# EAGLE schematic schematic (EAGLE 7.5.0)

## Sheet 1 of 3: Supply
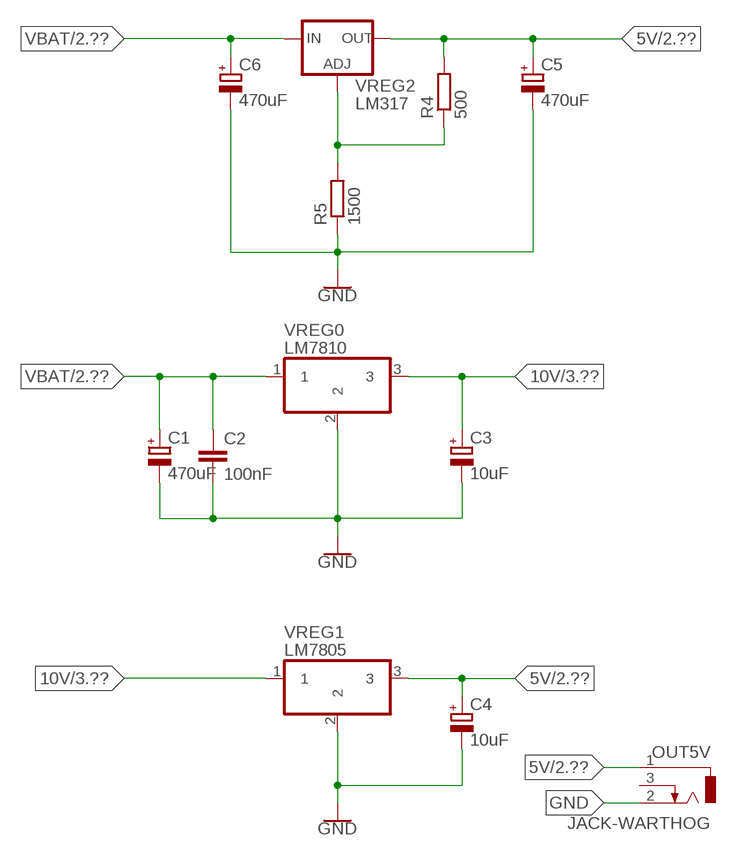
[diagram p0: schematic, sheet 1]

### Parts
C1  470uF  CPOL-EUE3.5-8  [E3,5-8]
C2  100nF  C-EUC0805  [C0805]
C3  10uF  CPOL-EUSMCC  [SMC_C]
C4  10uF  CPOL-EUSMCC  [SMC_C]
C5  470uF  CPOL-EUSMCC  [SMC_C]
C6  470uF  CPOL-EUSMCC  [SMC_C]
OUT5V  JACK-WARTHOG  [JACK-WARTHOG]
R4  500  R-EU_R0805  [R0805]
R5  1500  R-EU_R0805  [R0805]
VREG0  LM7810  TO220V-WARTHOG  [TO220V-WARTHOG]
VREG1  LM7805  TO220V-WARTHOG  [TO220V-WARTHOG]
VREG2  LM317  V_REG_317DPACK  [V-REG_DPACK]

### Nets
5V: C4.+ C5.+ OUT5V.1 R4.2 VREG1.3 VREG2.4(OUT) ; also sheet 2,3
10V: C3.+ VREG0.3 VREG1.1 ; also sheet 3
ADJ: R4.1 R5.2 VREG2.1(ADJ)
GND: C1.- C2.2 C3.- C4.- C5.- C6.- OUT5V.2 R5.1 VREG0.2 VREG1.2 ; also sheet 2,3
VBAT: C1.+ C2.1 C6.+ VREG0.1 VREG2.3(IN) ; also sheet 2,3
Unconnected: OUT5V.3

## Sheet 2 of 3
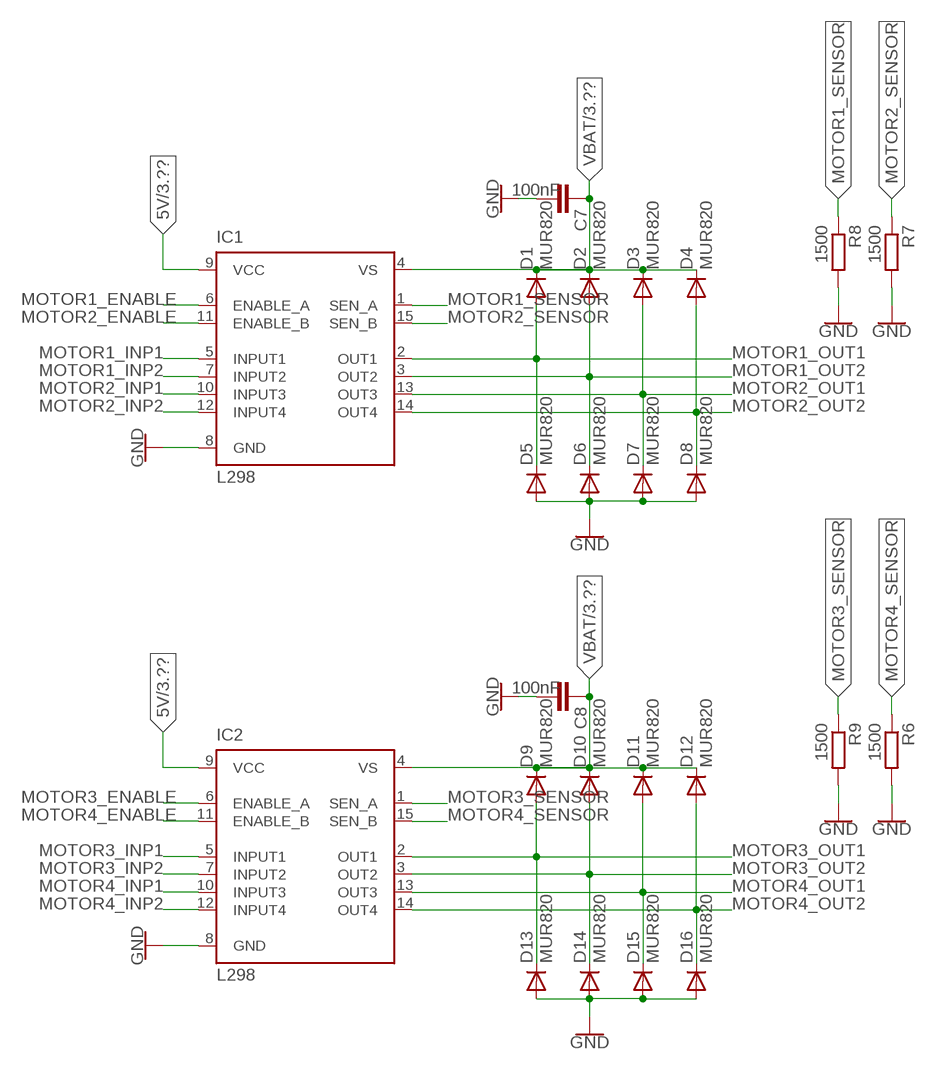
[diagram p1: schematic, sheet 2]

### Parts
C7  100nF  C-EUC0805  [C0805]
C8  100nF  C-EUC0805  [C0805]
D1  MUR820  [C221B1A]
D2  MUR820  [C221B1A]
D3  MUR820  [C221B1A]
D4  MUR820  [C221B1A]
D5  MUR820  [C221B1A]
D6  MUR820  [C221B1A]
D7  MUR820  [C221B1A]
D8  MUR820  [C221B1A]
D9  MUR820  [C221B1A]
D10  MUR820  [C221B1A]
D11  MUR820  [C221B1A]
D12  MUR820  [C221B1A]
D13  MUR820  [C221B1A]
D14  MUR820  [C221B1A]
D15  MUR820  [C221B1A]
D16  MUR820  [C221B1A]
IC1  L298  [MULTIWATT-15]
IC2  L298  [MULTIWATT-15]
R6  1500  R-EU_R0805  [R0805]
R7  1500  R-EU_R0805  [R0805]
R8  1500  R-EU_R0805  [R0805]
R9  1500  R-EU_R0805  [R0805]

### Nets
5V: IC1.9(VCC) IC2.9(VCC) ; also sheet 1,3
GND: C7.2 C8.2 D5.A D6.A D7.A D8.A D13.A D14.A D15.A D16.A IC1.8(GND) IC2.8(GND) R6.2 R7.2 R8.2 R9.2 ; also sheet 1,3
MOTOR1_ENABLE: IC1.6(ENABLE_A)
MOTOR1_INP1: IC1.5(INPUT1)
MOTOR1_INP2: IC1.7(INPUT2)
MOTOR1_OUT1: D1.A D5.C IC1.2(OUT1)
MOTOR1_OUT2: D2.A D6.C IC1.3(OUT2)
MOTOR1_SENSOR: IC1.1(SEN_A) R8.1
MOTOR2_ENABLE: IC1.11(ENABLE_B)
MOTOR2_INP1: IC1.10(INPUT3)
MOTOR2_INP2: IC1.12(INPUT4)
MOTOR2_OUT1: D3.A D7.C IC1.13(OUT3)
MOTOR2_OUT2: D4.A D8.C IC1.14(OUT4)
MOTOR2_SENSOR: IC1.15(SEN_B) R7.1
MOTOR3_ENABLE: IC2.6(ENABLE_A)
MOTOR3_INP1: IC2.5(INPUT1)
MOTOR3_INP2: IC2.7(INPUT2)
MOTOR3_OUT1: D9.A D13.C IC2.2(OUT1)
MOTOR3_OUT2: D10.A D14.C IC2.3(OUT2)
MOTOR3_SENSOR: IC2.1(SEN_A) R9.1
MOTOR4_ENABLE: IC2.11(ENABLE_B)
MOTOR4_INP1: IC2.10(INPUT3)
MOTOR4_INP2: IC2.12(INPUT4)
MOTOR4_OUT1: D11.A D15.C IC2.13(OUT3)
MOTOR4_OUT2: D12.A D16.C IC2.14(OUT4)
MOTOR4_SENSOR: IC2.15(SEN_B) R6.1
VBAT: C7.1 C8.1 D1.C D2.C D3.C D4.C D9.C D10.C D11.C D12.C IC1.4(VS) IC2.4(VS) ; also sheet 1,3

## Sheet 3 of 3: Debug
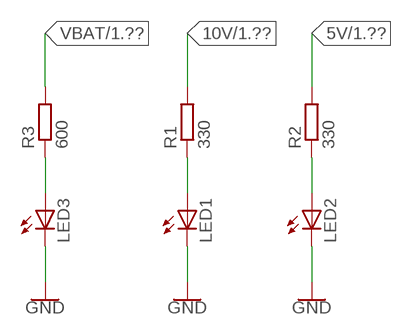
[diagram p2: schematic, sheet 3]

### Parts
LED1  LEDCHIP-LED0805  [CHIP-LED0805]
LED2  LEDCHIP-LED0805  [CHIP-LED0805]
LED3  LEDCHIP-LED0805  [CHIP-LED0805]
R1  330  R-EU_R0805  [R0805]
R2  330  R-EU_R0805  [R0805]
R3  600  R-EU_R0805  [R0805]

### Nets
5V: R2.2 ; also sheet 1,2
10V: R1.2 ; also sheet 1
GND: LED1.C LED2.C LED3.C ; also sheet 1,2
N$1: LED1.A R1.1
N$2: LED2.A R2.1
N$3: LED3.A R3.1
VBAT: R3.2 ; also sheet 1,2

## Library data of the parts
C1 C3-C6 = rcl:CPOL-EU: POLARIZED CAPACITOR, European symbol
C2 C7 C8 = rcl:C-EU: CAPACITOR, European symbol
D1-D16 = diode:MUR820: DIODE
IC1 IC2 = st-microelectronics:L298: DUAL FULL-BRIDGE DRIVER; MPN: L298N; OC_FARNELL: 1589425; OC_NEWARK: 32M1527
LED1-LED3 = adafruit_arduino:LED: LED OSRAM: - CHIPLED LG R971, LG N971, LY N971, LG Q971, LY Q971, LO R971, LY R971 LH N974, LH R974 LS Q976, LO Q976, LY Q976 LO Q996 - Hyper CHIPLED LW Q18S LB Q993, LB Q99A, LB R99A - SideLED LS A670, LO A670, LY A670, LG A670, LP A670 LB A673, LV A673, LT A673, LW A673 LH A674 LY A675 LS A676, LA A676, LO A676, LY A676, LW A676 LS A679, LY A679, LG A679 - Hyper Micro SIDELED® LS Y876, LA Y876, LO Y876, LY Y876 LT Y87S - SmartLED LW L88C, LW L88S LB L89C, LB L89S, LG L890 LS L89K, LO L89K, LY L89K LS L896, LA L896, LO L896, LY L896 - TOPLED LS T670, LO T670, LY T670, LG T670, LP T670 LSG T670, LSP T670, LSY T670, LOP T670, LYG T670 LG T671, LOG T671, LSG T671 LB T673, LV T673, LT T673, LW T673 LH T674 LS T676, LA T676, LO T676, LY T676, LB T676, LH T676, LSB T676, LW T676 LB T67C, LV T67C, LT T67C, LS T67K, LO T67K, LY T67K, LW E67C LS E67B, LA E67B, LO E67B, LY E67B, LB E67C, LV E67C, LT E67C LW T67C LS T679, LY T679, LG T679 LS T770, LO T770, LY T770, LG T770, LP T770 LB T773, LV T773, LT T773, LW T773 LH T774 LS E675, LA E675, LY E675, LS T675 LS T776, LA T776, LO T776, LY T776, LB T776 LHGB T686 LT T68C, LB T68C - Hyper Mini TOPLED® LB M676 - Mini TOPLED Santana® LG M470 LS M47K, LO M47K, LY M47K Source: http://www.osram.convergy.de/
OUT5V = JACK-WARTHOG:JACK-WARTHOG
R1-R9 = rcl:R-EU_: RESISTOR, European symbol
VREG0 VREG1 = TO220V-WARTHOG:TO220V-WARTHOG
VREG2 = SparkFun-IC-Power:V_REG_317: Voltage Regulator Standard LM317 adjustable voltage regulator. AOI (Adjust Output Input). Google 'LM317 Calculator' for easy to use app to get the two resistor values needed. 240/720 for 5V output. 240/390 for 3.3V output. Spark Fun Electronics SKU : COM-00527; PROD_ID: IC-09888